# Altium schematic sheet ADC&SSR.SchDoc
size A4
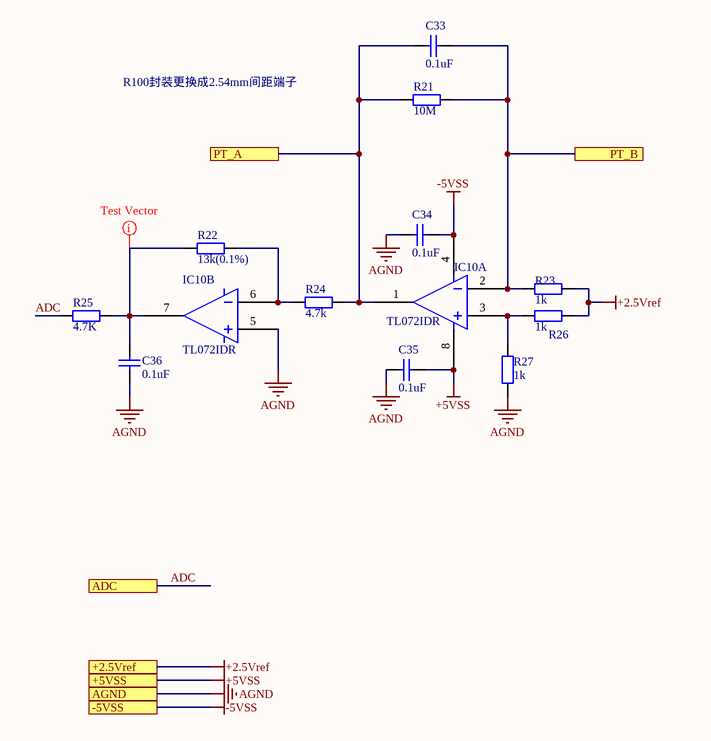
[diagram p0: ADC&SSR.SchDoc]

## Parts
C33  0.1uF  [0805C]
C34  0.1uF  [0805C]
C35  0.1uF  [0805C]
C36  0.1uF  [0805C]
IC10  TL072IDR  [SOP8]  (parts A,B of 2)
R21  10M  [0805R]
R22  13k(0.1%)  [0805R]
R23  1k  [0805R]
R24  4.7k  [0805R]
R25  4.7K  [0805R]
R26  1k  [0805R]
R27  1k  [0805R]

## Ports
+2.5Vref, +5VSS, -5VSS, ADC, AGND, PT_A, PT_B

## Nets
+2.5Vref: R23.1 R26.1 ; port +2.5Vref
+5VSS: C35.2 IC10.8 ; port +5VSS
-5VSS: C34.2 IC10.4 ; port -5VSS
AGND: C34.1 C35.1 C36.1 IC10.5 R27.2 ; port AGND
ADC: R25.2 ; port ADC
PT_A: C33.1 IC10.1 R21.1 R24.1 ; port PT_A
PT_B: C33.2 IC10.2 R21.2 R23.2 ; port PT_B
NetC36_2: C36.2 IC10.7 R22.2 R25.1
NetIC10_3: IC10.3 R26.2 R27.1
NetIC10_6: IC10.6 R22.1 R24.2

## Layout directives
Column: TestVectorIndex: NetC36_2

## Notes on the sheet
- R100封装更换成2.54mm间距端子

## Library data of the parts
C33 = Cap: 品牌： SAMSUNG(三星)   型号： CL21C101JBANNNC   容值：100pF 精度：±5% 额定电压：50V 材质(温度系数)：C0G 材质:C0G; Value: 0.1nF; Published: 8-Jun-2000; LatestRevisionDate: 17-Jul-2002; LatestRevisionNote: Re-released for DXP Platform.; PackageReference: RAD-0.3; Publisher: Altium Limited; PackageDescription: Radial Cap, Thru-Hole; 2 Leads; 0.3 in Pin Spacing
C34-C36 = Cap: 品牌： SAMSUNG(三星) 型号： CL21B104KBCNNNC ：容值：100nF 精度：±10% 额定电压：50V 材质(温度系数)：X7R 材质:X7R; Published: 8-Jun-2000; LatestRevisionDate: 17-Jul-2002; LatestRevisionNote: Re-released for DXP Platform.; PackageReference: RAD-0.3; Publisher: Altium Limited; PackageDescription: Radial Cap, Thru-Hole; 2 Leads; 0.3 in Pin Spacing; Value: 0.1uF
IC10 = TL072_1: 品牌： TI(德州仪器)   型号： TL072IDR  放大器组数：2 增益带宽积(GBP)：5.25MHz 压摆率(SR)：13V/us 输入失调电压(Vos)：3mV 输入偏置电流(Ib)：65pA TL072 双路低噪声 JFET 输入通用运算放大器
R21 = Res2: 品牌： Sunway(信维通信)   型号： SC0805J1005F4ANRH   阻值：10MΩ 精度：±5% 功率：125mW 温度系数：±100ppm/℃ 贴片厚膜电阻：体积0805_精度：±5% 阻值10M; Published: 8-Jun-2000; LatestRevisionDate: 17-Jul-2002; LatestRevisionNote: Re-released for DXP Platform.; PackageReference: AXIAL-0.4; Publisher: Altium Limited; PackageDescription: Axial Device, Thru-Hole; 2 Leads; 0.4 in Pin Spacing; Value: 10M
R22 = Res2: 品牌： UNI-ROYAL(厚声)  型号： 0805W8F1302T5E  电阻类型：厚膜电阻 阻值：13kΩ 精度：±1% 功率：125mW 温度系数：±100ppm/℃; Published: 8-Jun-2000; LatestRevisionDate: 17-Jul-2002; LatestRevisionNote: Re-released for DXP Platform.; PackageReference: AXIAL-0.4; Publisher: Altium Limited; PackageDescription: Axial Device, Thru-Hole; 2 Leads; 0.4 in Pin Spacing; Value: 13k(0.1%)
R23 R26 R27 = Res2: 品牌： UNI-ROYAL(厚声) 型号： 0805W8F1001T5E 电阻类型：厚膜电阻 阻值：1kΩ 精度：±1% 功率：125mW 温度系数：±100ppm/℃; Value: 1k(0.1%); Published: 8-Jun-2000; LatestRevisionDate: 17-Jul-2002; LatestRevisionNote: Re-released for DXP Platform.; PackageReference: AXIAL-0.4; Publisher: Altium Limited; PackageDescription: Axial Device, Thru-Hole; 2 Leads; 0.4 in Pin Spacing
R24 = Res2: 品牌： UNI-ROYAL(厚声) 型号： 0805W8F4701T5E 电阻类型：厚膜电阻 阻值：4.7kΩ 精度：±1% 功率：125mW 温度系数：±100ppm/℃; Value: 4.7k(0.1%); Published: 8-Jun-2000; LatestRevisionDate: 17-Jul-2002; LatestRevisionNote: Re-released for DXP Platform.; PackageReference: AXIAL-0.4; Publisher: Altium Limited; PackageDescription: Axial Device, Thru-Hole; 2 Leads; 0.4 in Pin Spacing
R25 = Res2: 品牌： UNI-ROYAL(厚声) 型号： 0805W8F4701T5E 电阻类型：厚膜电阻 阻值：4.7kΩ 精度：±1% 功率：125mW 温度系数：±100ppm/℃; Published: 8-Jun-2000; LatestRevisionDate: 17-Jul-2002; LatestRevisionNote: Re-released for DXP Platform.; PackageReference: AXIAL-0.4; Publisher: Altium Limited; PackageDescription: Axial Device, Thru-Hole; 2 Leads; 0.4 in Pin Spacing; Value: 4.7K